# Altium schematic sheet nrf52840_qfaa.SchDoc
size A4; Revision: 1.0; SheetNumber: 3; SheetTotal: 3; DrawnBy: RUBR; DocumentSize: A4; Device: nRF52840-QFAA; RefLayoutTitle: Reference Layout
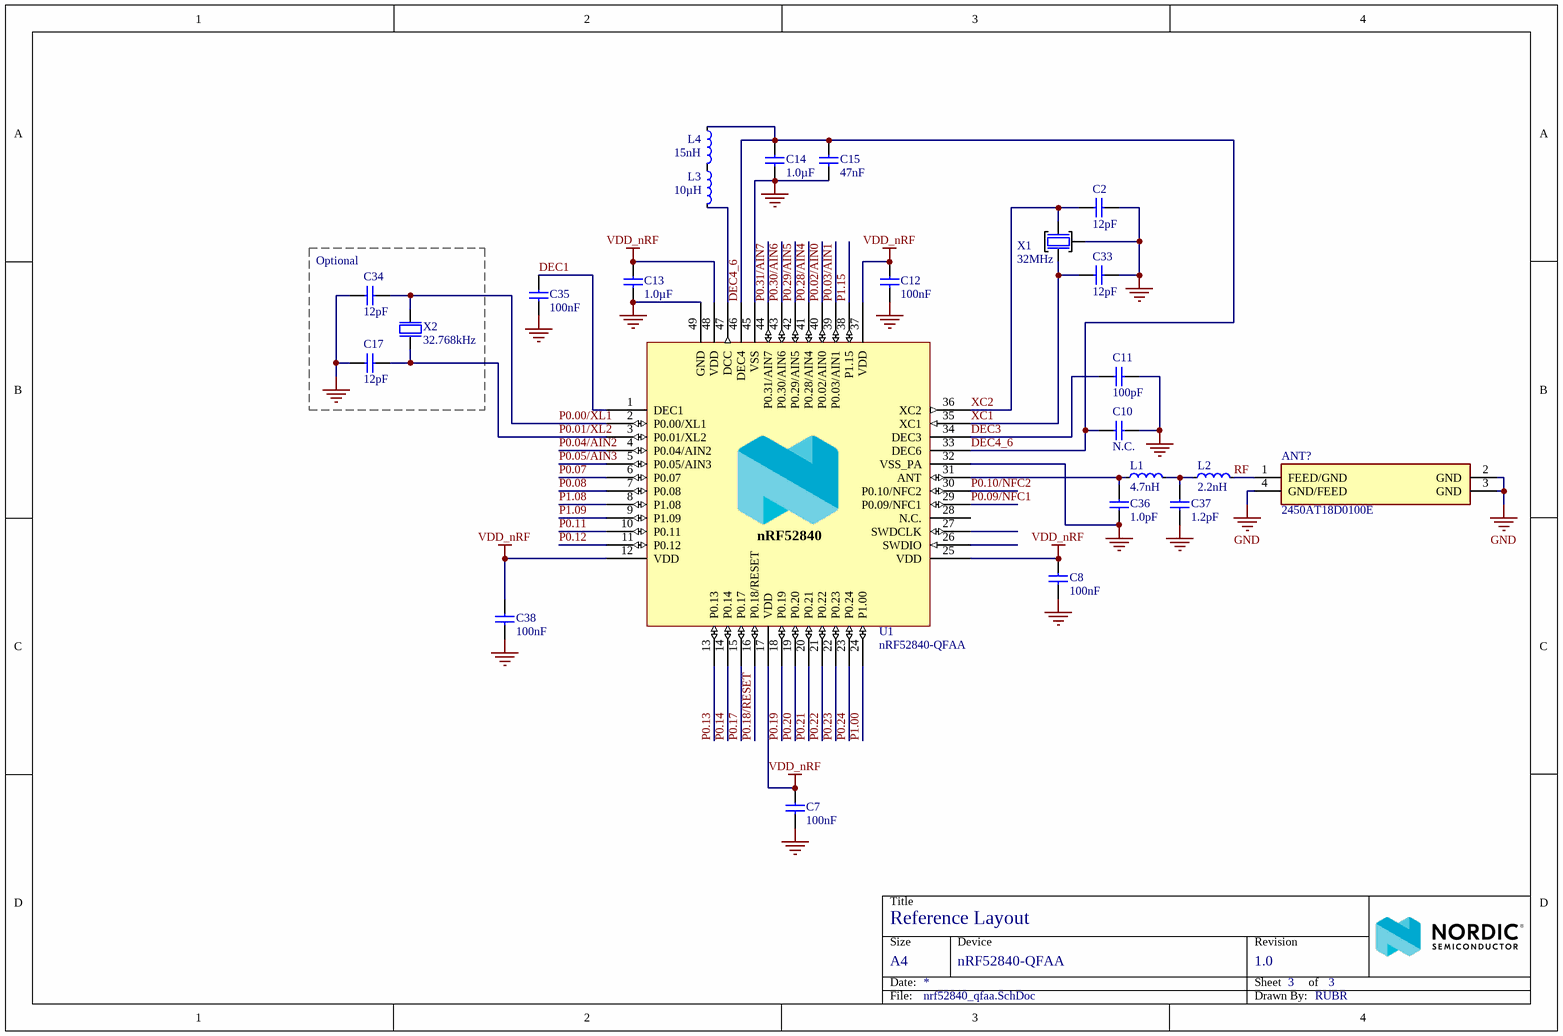
[diagram p0: nrf52840_qfaa.SchDoc]

## Parts
ANT?  2450AT18D0100E  [FP-2450AT18D0100E-MFG]
C2  12pF  [CAPC0603X03L_C]
C7  100nF  [CAPC0603X03L_C]
C8  100nF  [CAPC0603X03L_C]
C10  N.C.  [CAPC0603X03L_C_NC]
C11  100pF  [CAPC0603X03L_C]
C12  100nF  [CAPC0603X03L_C]
C13  1.0µF  [CAPC1005X04L]
C14  1.0µF  [CAPC1005X04L]
C15  47nF  [CAPC0603X03L_C]
C17  12pF  [CAPC0603X03L_C]
C33  12pF  [CAPC0603X03L_C]
C34  12pF  [CAPC0603X03L_C]
C35  100nF  [CAPC0603X03L_C]
C36  1.0pF  [CAPC0603X03L_C]
C37  1.2pF  [CAPC0603X03L_C]
C38  100nF  [CAPC0603X03L_C]
L1  4.7nH  [INDC0603X03L_C]
L2  2.2nH  [INDC0603X03L_C]
L3  10µH  [INDC1608X06L]
L4  15nH  [INDC1005X04L]
U1  nRF52840-QFAA  [QFN40P600X600X90-48N]
X1  32MHz  [XTAL_2016_NT]
X2  32.768kHz  [XTAL_2012]

## Blocks framed on the sheet
Optional: C17 C34 X2

## Nets
GND: ANT?.2(GND) ANT?.3(GND) ANT?.4(GND/FEED) C2.2 C7.2 C8.2 C10.1 C11.2 C12.2 C13.2 C14.1 C15.2 C17.2 C33.2 C34.2 C35.2 C36.1 C37.1 C38.2 U1.32(VSS_PA) U1.45(VSS) U1.49(GND) X1.2(GND)
VDD_nRF: C7.1 C8.1 C12.1 C13.1 C38.1 U1.12(VDD) U1.17(VDD) U1.25(VDD) U1.37(VDD) U1.48(VDD)
DEC1: C35.1 U1.1(DEC1)
DEC3: C11.1 U1.34(DEC3)
DEC4_6: C10.2 C14.2 C15.1 L4.1 U1.33(DEC6) U1.46(DEC4)
P0.00/XL1: C34.1 U1.2(P0.00/XL1) X2.1(inp)
P0.01/XL2: C17.1 U1.3(P0.01/XL2) X2.2(out)
P0.02/AIN0: U1.40(P0.02/AIN0)
P0.03/AIN1: U1.39(P0.03/AIN1)
P0.04/AIN2: U1.4(P0.04/AIN2)
P0.05/AIN3: U1.5(P0.05/AIN3)
P0.07: U1.6(P0.07)
P0.08: U1.7(P0.08)
P0.09/NFC1: U1.29(P0.09/NFC1)
P0.10/NFC2: U1.30(P0.10/NFC2)
P0.11: U1.10(P0.11)
P0.12: U1.11(P0.12)
P0.13: U1.13(P0.13)
P0.14: U1.14(P0.14)
P0.17: U1.15(P0.17)
P0.18/RESET: U1.16(P0.18/RESET)
P0.19: U1.18(P0.19)
P0.20: U1.19(P0.20)
P0.21: U1.20(P0.21)
P0.22: U1.21(P0.22)
P0.23: U1.22(P0.23)
P0.24: U1.23(P0.24)
P0.28/AIN4: U1.41(P0.28/AIN4)
P0.29/AIN5: U1.42(P0.29/AIN5)
P0.30/AIN6: U1.43(P0.30/AIN6)
P0.31/AIN7: U1.44(P0.31/AIN7)
P1.00: U1.24(P1.00)
P1.08: U1.8(P1.08)
P1.09: U1.9(P1.09)
P1.15: U1.38(P1.15)
RF: ANT?.1(FEED/GND) L2.2
XC1: C33.1 U1.35(XC1) X1.1(IN)
XC2: C2.1 U1.36(XC2) X1.3(OUT)
NetC36_2: C36.2 L1.1 U1.31(ANT)
NetC37_2: C37.2 L1.2 L2.1
NetL3_1: L3.1 L4.2
NetL3_2: L3.2 U1.47(DCC)

Not connected (* = marked no-connect by the designer): U1 26(SWDIO) 27(SWDCLK) 28(N.C.)

## Notes on the sheet
- Title
- Size
- Date:
- A4
- Device
- Sheet         of
- Revision
- File:
- Drawn By:
- (in symbol nRF52840-QFAA) nRF52840

## Library data of the parts
ANT? = CMP-2000-05543-2: RF ANT 2.4GHZ CHIP SOLDER SMD; Gain: -1dB; Bandwidth: 100MHz; Frequency: 2.45GHz; Power Rating: 2W; Impedance: 50R; Number of Bands: 1; Return Loss: -10dB; Case/Package: SMD/SMT; Width: 1.6mm; RoHS Compliant: Yes; Package Quantity: 3000; Height: 0.047inch; Series: -; Max Power Dissipation: 2W; Mount: Surface Mount; Termination: Solder; Radiation Hardening: No; Packaging: Tape and Reel; Length: 3.2mm
C2 C17 C33 C34 = C0201-12p: Capacitor, NP0, ±2%; Pad Count: 2; Part Number: C0201-12p; LatestRevisionDate: 2017-11-09; Published: 2014-11-13; Value: 12pF; Footprint Doc: 0201; Component Class: Capacitors
C7 C8 C12 C35 C38 = C0201-100n: Capacitor, X5R, ±10%; Pad Count: 2; Part Number: C0201-100n; LatestRevisionDate: 2017-11-09; Published: 2014-11-13; Value: 100nF; Footprint Doc: 0201; Component Class: Capacitors
C10 = C0201-N.C.: Not mounted; Assembly: Not mounted; Pad Count: 2; Part Number: C0201-N.C.; LatestRevisionDate: 2014-11-13; Published: 2014-11-13; Value: N.C.; Footprint Doc: 0201; Component Class: Capacitors
C11 = C0201-100p: Capacitor, NP0, ±5%; Pad Count: 2; Part Number: C0201-100p; LatestRevisionDate: 2019-04-16; Published: 2019-04-16; Value: 100pF; Footprint Doc: 0201; Component Class: Capacitors
C13 C14 = C0402-1µ0: Capacitor, X5R, ±10%; Pad Count: 2; Part Number: C0402-1µ0; LatestRevisionDate: 2016-08-22; Published: 2009-05-08; Value: 1.0µF; Footprint Doc: 0402; Component Class: Capacitors
C15 = C0201-47n: Capacitor, X5R, ±10%; Pad Count: 2; Part Number: C0201-47n; LatestRevisionDate: 2017-11-09; Published: 2014-11-13; Value: 47nF; Footprint Doc: 0201; Component Class: Capacitors
C36 = C0201-1.0p: Capacitor, NP0, ±10%; Pad Count: 2; Part Number: C0201-1.0p; LatestRevisionDate: 2018-10-22; Published: 2014-11-13; Value: 1.0pF; Footprint Doc: 0201; Component Class: Capacitors
C37 = C0201-1.2p: Capacitor, NP0, ±10%; Pad Count: 2; Part Number: C0201-1.2p; LatestRevisionDate: 2020-10-13; Published: 2014-11-13; Value: 1.2pF; Footprint Doc: 0201; Component Class: Capacitors
L1 = L0201-4n7: High frequency chip inductor ±5%; Pad Count: 2; Part Number: L0201-4n7; LatestRevisionDate: 2013-04-10; Published: 2013-04-10; Value: 4.7nH; Footprint Doc: 0201; Component Class: Inductors
L2 = L0201-2n2: High frequency chip inductor ±5%; Pad Count: 2; Part Number: L0201-2n2; LatestRevisionDate: 2013-04-10; Published: 2013-04-10; Value: 2.2nH; Footprint Doc: 0201; Component Class: Inductors
L3 = L0603-10µ-TDK: Chip inductor, IDC,min = 50 mA, ±20%; Pad Count: 2; Part Number: L0603-10µ-TDK; LatestRevisionDate: 2012-09-19; Published: 2019-05-06; Value: 10µH; Footprint Doc: 0603; Component Class: Inductors
L4 = L0402-15n: High frequency chip inductor ±10%; Pad Count: 2; Part Number: L0402-15n; LatestRevisionDate: 2012-09-19; Published: 2010-07-12; Value: 15nH; Footprint Doc: 0402; Component Class: Inductors
U1 = nRF52840-QFAA: Multi-protocol Bluetooth Low Energy, IEEE 802.15.4, ANT and 2.4GHz proprietary system-on-chip; Pad Count: 48; Part Number: nRF52840-QFAA; LatestRevisionDate: 2016-11-22; Published: 2016-03-31; Value: nRF52840-QFAA; Footprint Doc: QFN-48; Component Class: nRF_Devices
X1 = XTAL_SMD2016_32MHz_8pF_General_NT: XTAL SMD 2016, 32MHz, Cl=8pF, Total Tol: ±30ppm; Pad Count: 4; Part Number: XTAL_SMD2016_32MHz_8pF_General_NT; LatestRevisionDate: 2021-04-08; Published: 2021-04-08; Value: 32MHz; Footprint Doc: XTAL_2016; Component Class: Oscillators
X2 = XTAL_SMD2012_32.768kHz_9pF_General: XTAL SMD 2012, 32.768kHz, Cl=9pF, Total Tol: ±50ppm; Pad Count: 2; Part Number: XTAL_SMD2012_32.768kHz_9pF_General; LatestRevisionDate: 2017-01-11; Published: 2016-08-19; Value: 32.768kHz; Footprint Doc: XTAL_2012; Component Class: Oscillators